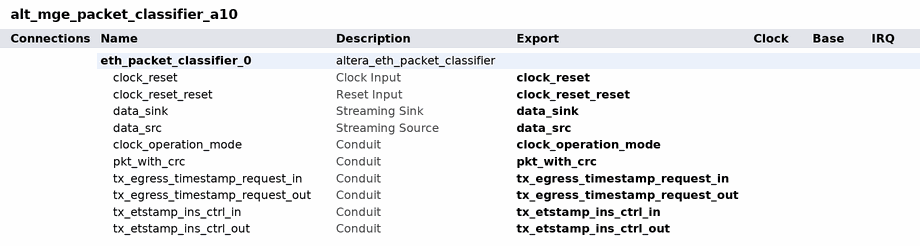
[diagram p0: system contents]
# Platform Designer (Qsys) system alt_mge_packet_classifier_a10, Arria 10 10AX115S4F45I3SG
# Parameters at their usual value, and those the tool derives, are not listed.
package require -exact qsys 15.1
create_system alt_mge_packet_classifier_a10
set_project_property DEVICE_FAMILY {Arria 10}
set_project_property DEVICE 10AX115S4F45I3SG

add_instance eth_packet_classifier_0 altera_eth_packet_classifier 15.1
set_instance_property eth_packet_classifier_0 AUTO_EXPORT true
set_instance_parameter_value eth_packet_classifier_0 BITSPERSYMBOL 8
set_instance_parameter_value eth_packet_classifier_0 SYMBOLSPERBEAT 4
set_instance_parameter_value eth_packet_classifier_0 TSTAMP_FP_WIDTH 4

# exported interfaces
add_interface clock_operation_mode conduit end
set_interface_property clock_operation_mode EXPORT_OF eth_packet_classifier_0.clock_operation_mode
add_interface clock_reset clock sink
set_interface_property clock_reset EXPORT_OF eth_packet_classifier_0.clock_reset
add_interface clock_reset_reset reset sink
set_interface_property clock_reset_reset EXPORT_OF eth_packet_classifier_0.clock_reset_reset
add_interface data_sink avalon_streaming sink
set_interface_property data_sink EXPORT_OF eth_packet_classifier_0.data_sink
add_interface data_src avalon_streaming source
set_interface_property data_src EXPORT_OF eth_packet_classifier_0.data_src
add_interface pkt_with_crc conduit end
set_interface_property pkt_with_crc EXPORT_OF eth_packet_classifier_0.pkt_with_crc
add_interface tx_egress_timestamp_request_in conduit end
set_interface_property tx_egress_timestamp_request_in EXPORT_OF eth_packet_classifier_0.tx_egress_timestamp_request_in
add_interface tx_egress_timestamp_request_out conduit end
set_interface_property tx_egress_timestamp_request_out EXPORT_OF eth_packet_classifier_0.tx_egress_timestamp_request_out
add_interface tx_etstamp_ins_ctrl_in conduit end
set_interface_property tx_etstamp_ins_ctrl_in EXPORT_OF eth_packet_classifier_0.tx_etstamp_ins_ctrl_in
add_interface tx_etstamp_ins_ctrl_out conduit end
set_interface_property tx_etstamp_ins_ctrl_out EXPORT_OF eth_packet_classifier_0.tx_etstamp_ins_ctrl_out

set_interconnect_requirement {$system} qsys_mm.clockCrossingAdapter HANDSHAKE
set_interconnect_requirement {$system} qsys_mm.enableEccProtection FALSE
set_interconnect_requirement {$system} qsys_mm.insertDefaultSlave FALSE
set_interconnect_requirement {$system} qsys_mm.maxAdditionalLatency 1

save_system alt_mge_packet_classifier_a10.qsys
